# EAGLE board Adafruit IS31FL3741 Matrix (EAGLE 9.6.2)
REV: A
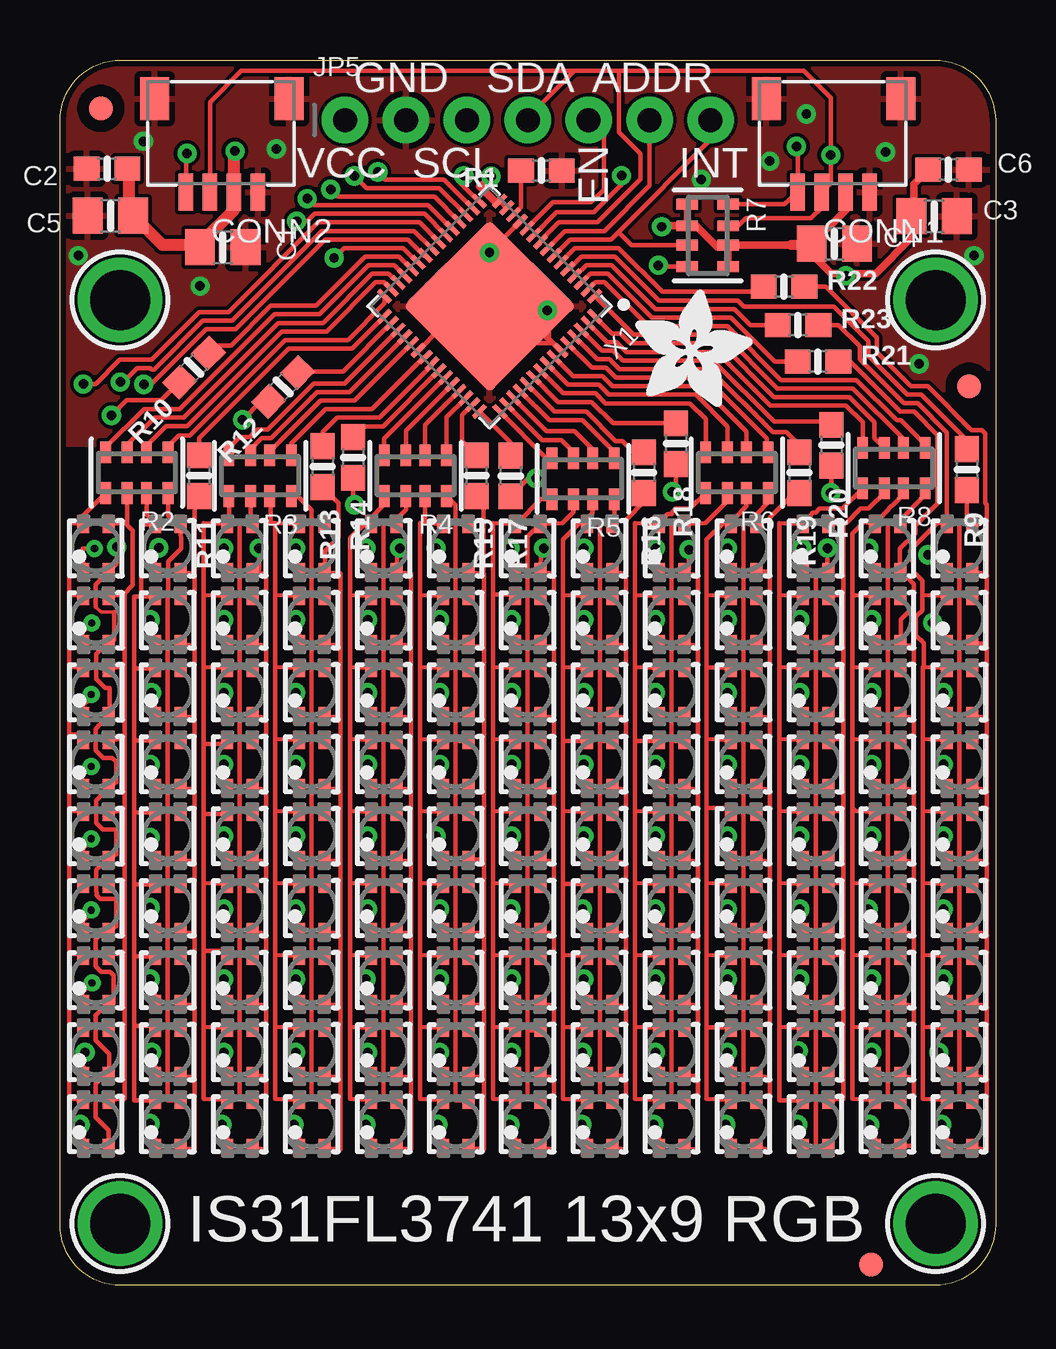
[diagram p2: board, top side]
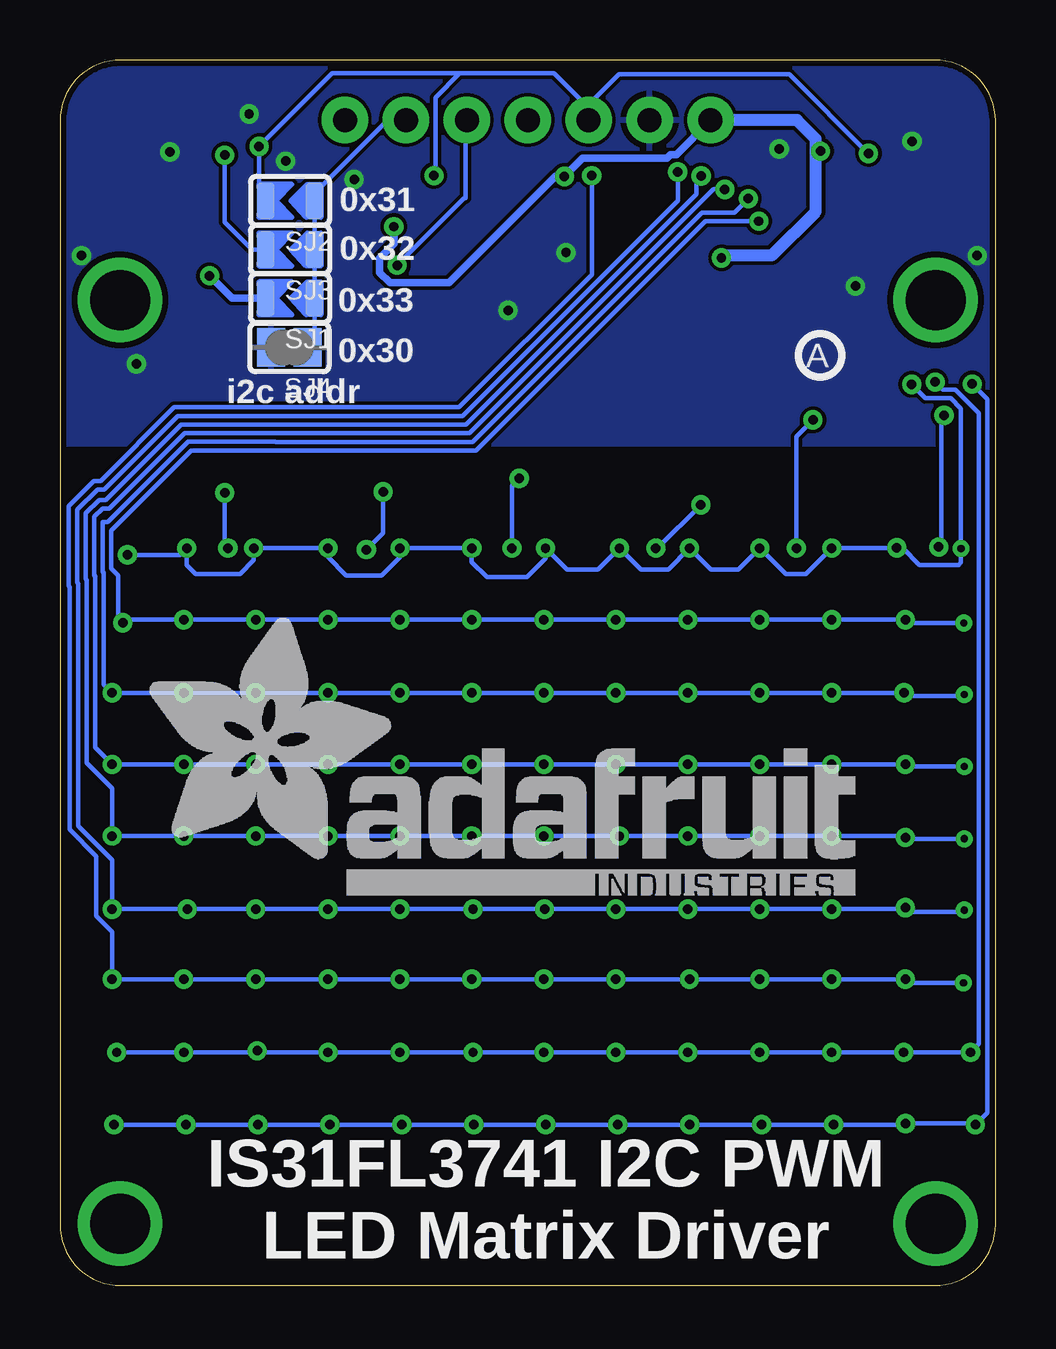
[diagram p3: board, bottom side, seen from below]

Size 39 x 51.08 mm. Coordinates in mm from the lower left corner, seen from the top.
Outline: 39,48.54 39,2.54 arc-90 36.46,0 2.54,0 arc-90 0,2.54 0,48.54 arc-90 2.54,51.08 36.46,51.08 arc-90 39,48.54
Copper layers (1*16): Top 0.035mm / dielectric 1.5mm / Bottom 0.035mm
Design rules "adafruit 6-6": minimum track width 6mil, minimum drill 15.5mil, track to track 6mil, track to pad 6mil, pad to pad 6mil, via to via 6mil, smd to smd 6mil, copper to edge 10mil, drill to drill 8mil, minimum pad ring 10mil, minimum via ring 8mil, stop-mask expansion 2mil, vias tented up to drill 20mil, thermal gap 10mil
Net classes: 1 vcc: width 0.305 mm

## Footprints (pad centres in the part's own frame; a part is rotated, then mirrored left to right if it is on the bottom)
0805-NO = smd 1.24 x 1.5: 1 -0.95,0; 2 0.95,0
0603-NO = smd 1.075 x 1: 1 -0.85,0; 2 0.85,0
JST_SH4 = smd 0.6 x 1.55: 1 -1.5,2.514; 2 -0.5,2.514; 3 0.5,2.514; 4 1.5,2.514 | smd 1.2 x 1.8: MT1 -2.8,-1.386; MT2 2.8,-1.386
FIDUCIAL_1MM = smd 1 x 1: 1 0,0
1X07_ROUND_76 = drill 1 pad 1.93: 1 -7.62,0; 2 -5.08,0; 3 -2.54,0; 4 0,0; 5 2.54,0; 6 5.08,0; 7 7.62,0
RGBLED_2121 = smd 0.75 x 0.5: A -1.05,0.525; B 0.95,0.525; G 0.95,-0.525; R -1.05,-0.525
RESPACK_4X0603 = smd 0.45 x 0.9: 1 -1.3,-0.85; 2 -0.4,-0.85; 3 0.4,-0.85; 4 1.3,-0.85; 5 1.3,0.85; 6 0.4,0.85; 7 -0.4,0.85; 8 -1.3,0.85
SOLDERJUMPER_ARROW_NOPASTE = smd 0.762 x 1.524: 1 -1.016,0; 2 1.016,0
SOLDERJUMPER_CLOSEDWIRE = smd 1.168 x 1.6: 1 -0.762,0; 2 0.762,0 | smd 0.635 x 0.203: WIRE 0,0
MOUNTINGHOLE_2.5_PLATED = drill 2.5 pad 3.2: P$1 0,0
QFN60_7MM = smd 0.7 x 0.2: 1 -3.4,2.8; 2 -3.4,2.4; 3 -3.4,2; 4 -3.4,1.6; 5 -3.4,1.2; 6 -3.4,0.8; 7 -3.4,0.4; 8 -3.4,0; 9 -3.4,-0.4; 10 -3.4,-0.8; 11 -3.4,-1.2; 12 -3.4,-1.6; 13 -3.4,-2; 14 -3.4,-2.4; 15 -3.4,-2.8; 31 3.4,-2.8; 32 3.4,-2.4; 33 3.4,-2; 34 3.4,-1.6; 35 3.4,-1.2; 36 3.4,-0.8; 37 3.4,-0.4; 38 3.4,0; 39 3.4,0.4; 40 3.4,0.8; 41 3.4,1.2; 42 3.4,1.6; 43 3.4,2; 44 3.4,2.4; 45 3.4,2.8 | smd 0.2 x 0.7: 16 -2.8,-3.4; 17 -2.4,-3.4; 18 -2,-3.4; 19 -1.6,-3.4; 20 -1.2,-3.4; 21 -0.8,-3.4; 22 -0.4,-3.4; 23 0,-3.4; 24 0.4,-3.4; 25 0.8,-3.4; 26 1.2,-3.4; 27 1.6,-3.4; 28 2,-3.4; 29 2.4,-3.4; 30 2.8,-3.4; 46 2.8,3.4; 47 2.4,3.4; 48 2,3.4; 49 1.6,3.4; 50 1.2,3.4; 51 0.8,3.4; 52 0.4,3.4; 53 0,3.4; 54 -0.4,3.4; 55 -0.8,3.4; 56 -1.2,3.4; 57 -1.6,3.4; 58 -2,3.4; 59 -2.4,3.4; 60 -2.8,3.4 | smd 5.1 x 5.1: THERMAL 0,0

## Placement (x,y rotation side)
C1  10uF  [0805-NO]  6.79,43.27 0 top
C2  1uF  [0603-NO]  1.96,46.55 180 top
C3  10uF  [0805-NO]  36.44,44.56 0 top
C4  10uF  [0805-NO]  32.28,43.41 0 top
C5  10uF  [0805-NO]  2.11,44.58 180 top
C6  1uF  [0603-NO]  37.04,46.51 0 top
CONN1  STEMMA_I2C_QT  [JST_SH4]  32.25,48.08 180 top
CONN2  STEMMA_I2C_QT  [JST_SH4]  6.75,48.08 180 top
FID1  FIDUCIAL_1MM  [FIDUCIAL_1MM]  1.7,49.07 0 top
FID2  FIDUCIAL_1MM  [FIDUCIAL_1MM]  33.8,0.86 0 top
FID3  FIDUCIAL_1MM  [FIDUCIAL_1MM]  37.9,37.48 0 top
JP5  [1X07_ROUND_76]  19.5,48.58 0 top
LED1  RGBLED_CA_2121  [RGBLED_2121]  1.5,30.78 90 top
LED2  RGBLED_CA_2121  [RGBLED_2121]  4.5,30.78 90 top
LED3  RGBLED_CA_2121  [RGBLED_2121]  7.5,30.78 90 top
LED4  RGBLED_CA_2121  [RGBLED_2121]  10.5,30.78 90 top
LED5  RGBLED_CA_2121  [RGBLED_2121]  13.5,30.78 90 top
LED6  RGBLED_CA_2121  [RGBLED_2121]  16.5,30.78 90 top
LED7  RGBLED_CA_2121  [RGBLED_2121]  19.5,30.78 90 top
LED8  RGBLED_CA_2121  [RGBLED_2121]  22.5,30.78 90 top
LED9  RGBLED_CA_2121  [RGBLED_2121]  25.5,30.78 90 top
LED10  RGBLED_CA_2121  [RGBLED_2121]  28.5,30.78 90 top
LED11  RGBLED_CA_2121  [RGBLED_2121]  31.5,30.78 90 top
LED12  RGBLED_CA_2121  [RGBLED_2121]  34.5,30.78 90 top
LED13  RGBLED_CA_2121  [RGBLED_2121]  37.5,30.78 90 top
LED14  RGBLED_CA_2121  [RGBLED_2121]  1.5,27.78 90 top
LED15  RGBLED_CA_2121  [RGBLED_2121]  4.5,27.78 90 top
LED16  RGBLED_CA_2121  [RGBLED_2121]  7.5,27.78 90 top
LED17  RGBLED_CA_2121  [RGBLED_2121]  10.5,27.78 90 top
LED18  RGBLED_CA_2121  [RGBLED_2121]  13.5,27.78 90 top
LED19  RGBLED_CA_2121  [RGBLED_2121]  16.5,27.78 90 top
LED20  RGBLED_CA_2121  [RGBLED_2121]  19.5,27.78 90 top
LED21  RGBLED_CA_2121  [RGBLED_2121]  22.5,27.78 90 top
LED22  RGBLED_CA_2121  [RGBLED_2121]  25.5,27.78 90 top
LED23  RGBLED_CA_2121  [RGBLED_2121]  28.5,27.78 90 top
LED24  RGBLED_CA_2121  [RGBLED_2121]  31.5,27.78 90 top
LED25  RGBLED_CA_2121  [RGBLED_2121]  34.5,27.78 90 top
LED26  RGBLED_CA_2121  [RGBLED_2121]  37.5,27.78 90 top
LED27  RGBLED_CA_2121  [RGBLED_2121]  1.5,24.78 90 top
LED28  RGBLED_CA_2121  [RGBLED_2121]  4.5,24.78 90 top
LED29  RGBLED_CA_2121  [RGBLED_2121]  7.5,24.78 90 top
LED30  RGBLED_CA_2121  [RGBLED_2121]  10.5,24.78 90 top
LED31  RGBLED_CA_2121  [RGBLED_2121]  13.5,24.78 90 top
LED32  RGBLED_CA_2121  [RGBLED_2121]  16.5,24.78 90 top
LED33  RGBLED_CA_2121  [RGBLED_2121]  19.5,24.78 90 top
LED34  RGBLED_CA_2121  [RGBLED_2121]  22.5,24.78 90 top
LED35  RGBLED_CA_2121  [RGBLED_2121]  25.5,24.78 90 top
LED36  RGBLED_CA_2121  [RGBLED_2121]  28.5,24.78 90 top
LED37  RGBLED_CA_2121  [RGBLED_2121]  31.5,24.78 90 top
LED38  RGBLED_CA_2121  [RGBLED_2121]  34.5,24.78 90 top
LED39  RGBLED_CA_2121  [RGBLED_2121]  37.5,24.78 90 top
LED40  RGBLED_CA_2121  [RGBLED_2121]  1.5,21.78 90 top
LED41  RGBLED_CA_2121  [RGBLED_2121]  4.5,21.78 90 top
LED42  RGBLED_CA_2121  [RGBLED_2121]  7.5,21.78 90 top
LED43  RGBLED_CA_2121  [RGBLED_2121]  10.5,21.78 90 top
LED44  RGBLED_CA_2121  [RGBLED_2121]  13.5,21.78 90 top
LED45  RGBLED_CA_2121  [RGBLED_2121]  16.5,21.78 90 top
LED46  RGBLED_CA_2121  [RGBLED_2121]  19.5,21.78 90 top
LED47  RGBLED_CA_2121  [RGBLED_2121]  22.5,21.78 90 top
LED48  RGBLED_CA_2121  [RGBLED_2121]  25.5,21.78 90 top
LED49  RGBLED_CA_2121  [RGBLED_2121]  28.5,21.78 90 top
LED50  RGBLED_CA_2121  [RGBLED_2121]  31.5,21.78 90 top
LED51  RGBLED_CA_2121  [RGBLED_2121]  34.5,21.78 90 top
LED52  RGBLED_CA_2121  [RGBLED_2121]  37.5,21.78 90 top
LED53  RGBLED_CA_2121  [RGBLED_2121]  1.5,18.78 90 top
LED54  RGBLED_CA_2121  [RGBLED_2121]  4.5,18.78 90 top
LED55  RGBLED_CA_2121  [RGBLED_2121]  7.5,18.78 90 top
LED56  RGBLED_CA_2121  [RGBLED_2121]  10.5,18.78 90 top
LED57  RGBLED_CA_2121  [RGBLED_2121]  13.5,18.78 90 top
LED58  RGBLED_CA_2121  [RGBLED_2121]  16.5,18.78 90 top
LED59  RGBLED_CA_2121  [RGBLED_2121]  19.5,18.78 90 top
LED60  RGBLED_CA_2121  [RGBLED_2121]  22.5,18.78 90 top
LED61  RGBLED_CA_2121  [RGBLED_2121]  25.5,18.78 90 top
LED62  RGBLED_CA_2121  [RGBLED_2121]  28.5,18.78 90 top
LED63  RGBLED_CA_2121  [RGBLED_2121]  31.5,18.78 90 top
LED64  RGBLED_CA_2121  [RGBLED_2121]  34.5,18.78 90 top
LED65  RGBLED_CA_2121  [RGBLED_2121]  37.5,18.78 90 top
LED66  RGBLED_CA_2121  [RGBLED_2121]  1.5,15.78 90 top
LED67  RGBLED_CA_2121  [RGBLED_2121]  4.5,15.78 90 top
LED68  RGBLED_CA_2121  [RGBLED_2121]  7.5,15.78 90 top
LED69  RGBLED_CA_2121  [RGBLED_2121]  10.5,15.78 90 top
LED70  RGBLED_CA_2121  [RGBLED_2121]  13.5,15.78 90 top
LED71  RGBLED_CA_2121  [RGBLED_2121]  16.5,15.78 90 top
LED72  RGBLED_CA_2121  [RGBLED_2121]  19.5,15.78 90 top
LED73  RGBLED_CA_2121  [RGBLED_2121]  22.5,15.78 90 top
LED74  RGBLED_CA_2121  [RGBLED_2121]  25.5,15.78 90 top
LED75  RGBLED_CA_2121  [RGBLED_2121]  28.5,15.78 90 top
LED76  RGBLED_CA_2121  [RGBLED_2121]  31.5,15.78 90 top
LED77  RGBLED_CA_2121  [RGBLED_2121]  34.5,15.78 90 top
LED78  RGBLED_CA_2121  [RGBLED_2121]  37.5,15.78 90 top
LED79  RGBLED_CA_2121  [RGBLED_2121]  1.5,12.78 90 top
LED80  RGBLED_CA_2121  [RGBLED_2121]  4.5,12.78 90 top
LED81  RGBLED_CA_2121  [RGBLED_2121]  7.5,12.78 90 top
LED82  RGBLED_CA_2121  [RGBLED_2121]  10.5,12.78 90 top
LED83  RGBLED_CA_2121  [RGBLED_2121]  13.5,12.78 90 top
LED84  RGBLED_CA_2121  [RGBLED_2121]  16.5,12.78 90 top
LED85  RGBLED_CA_2121  [RGBLED_2121]  19.5,12.78 90 top
LED86  RGBLED_CA_2121  [RGBLED_2121]  22.5,12.78 90 top
LED87  RGBLED_CA_2121  [RGBLED_2121]  25.5,12.78 90 top
LED88  RGBLED_CA_2121  [RGBLED_2121]  28.5,12.78 90 top
LED89  RGBLED_CA_2121  [RGBLED_2121]  31.5,12.78 90 top
LED90  RGBLED_CA_2121  [RGBLED_2121]  34.5,12.78 90 top
LED91  RGBLED_CA_2121  [RGBLED_2121]  37.5,12.78 90 top
LED92  RGBLED_CA_2121  [RGBLED_2121]  1.5,9.78 90 top
LED93  RGBLED_CA_2121  [RGBLED_2121]  4.5,9.78 90 top
LED94  RGBLED_CA_2121  [RGBLED_2121]  7.5,9.78 90 top
LED95  RGBLED_CA_2121  [RGBLED_2121]  10.5,9.78 90 top
LED96  RGBLED_CA_2121  [RGBLED_2121]  13.5,9.78 90 top
LED97  RGBLED_CA_2121  [RGBLED_2121]  16.5,9.78 90 top
LED98  RGBLED_CA_2121  [RGBLED_2121]  19.5,9.78 90 top
LED99  RGBLED_CA_2121  [RGBLED_2121]  22.5,9.78 90 top
LED100  RGBLED_CA_2121  [RGBLED_2121]  25.5,9.78 90 top
LED101  RGBLED_CA_2121  [RGBLED_2121]  28.5,9.78 90 top
LED102  RGBLED_CA_2121  [RGBLED_2121]  31.5,9.78 90 top
LED103  RGBLED_CA_2121  [RGBLED_2121]  34.5,9.78 90 top
LED104  RGBLED_CA_2121  [RGBLED_2121]  37.5,9.78 90 top
LED105  RGBLED_CA_2121  [RGBLED_2121]  1.5,6.78 90 top
LED106  RGBLED_CA_2121  [RGBLED_2121]  4.5,6.78 90 top
LED107  RGBLED_CA_2121  [RGBLED_2121]  7.5,6.78 90 top
LED108  RGBLED_CA_2121  [RGBLED_2121]  10.5,6.78 90 top
LED109  RGBLED_CA_2121  [RGBLED_2121]  13.5,6.78 90 top
LED110  RGBLED_CA_2121  [RGBLED_2121]  16.5,6.78 90 top
LED111  RGBLED_CA_2121  [RGBLED_2121]  19.5,6.78 90 top
LED112  RGBLED_CA_2121  [RGBLED_2121]  22.5,6.78 90 top
LED113  RGBLED_CA_2121  [RGBLED_2121]  25.5,6.78 90 top
LED114  RGBLED_CA_2121  [RGBLED_2121]  28.5,6.78 90 top
LED115  RGBLED_CA_2121  [RGBLED_2121]  31.5,6.78 90 top
LED116  RGBLED_CA_2121  [RGBLED_2121]  34.5,6.78 90 top
LED117  RGBLED_CA_2121  [RGBLED_2121]  37.5,6.78 90 top
R1  2.2K  [0603-NO]  20.07,46.47 180 top
R2  22  [RESPACK_4X0603]  3.21,33.88 180 top
R3  22  [RESPACK_4X0603]  8.34,33.75 180 top
R4  22  [RESPACK_4X0603]  14.82,33.75 180 top
R5  22  [RESPACK_4X0603]  21.8,33.62 180 top
R6  22  [RESPACK_4X0603]  28.22,33.88 180 top
R7  4.7K  [RESPACK_4X0603]  27,43.76 270 top
R8  22  [RESPACK_4X0603]  34.76,34.07 180 top
R9  22  [0603-NO]  37.81,34.01 270 top
R10  51  [0603-NO]  5.59,38.26 225 top
R11  51  [0603-NO]  5.8,33.75 270 top
R12  51  [0603-NO]  9.3,37.45 225 top
R13  51  [0603-NO]  10.95,34.13 270 top
R14  51  [0603-NO]  12.22,34.51 270 top
R15  51  [0603-NO]  17.36,33.75 270 top
R16  51  [0603-NO]  24.34,33.88 270 top
R17  51  [0603-NO]  18.79,33.75 270 top
R18  51  [0603-NO]  25.68,35.09 270 top
R19  51  [0603-NO]  30.82,33.88 270 top
R20  51  [0603-NO]  32.16,35.02 270 top
R21  51  [0603-NO]  31.6,38.5 0 top
R22  51  [0603-NO]  30.19,41.63 0 top
R23  22  [0603-NO]  30.76,40.03 0 top
SJ1  [SOLDERJUMPER_ARROW_NOPASTE]  29.41,41.15 180 bottom
SJ2  [SOLDERJUMPER_ARROW_NOPASTE]  29.41,45.21 180 bottom
SJ3  [SOLDERJUMPER_ARROW_NOPASTE]  29.41,43.18 180 bottom
SJ4  [SOLDERJUMPER_CLOSEDWIRE]  29.44,39.1 180 bottom
U$3  MOUNTINGHOLE2.5  [MOUNTINGHOLE_2.5_PLATED]  2.5,2.58 0 top
U$4  MOUNTINGHOLE2.5  [MOUNTINGHOLE_2.5_PLATED]  36.5,2.58 0 top
U$5  MOUNTINGHOLE2.5  [MOUNTINGHOLE_2.5_PLATED]  2.5,41.08 180 top
U$6  MOUNTINGHOLE2.5  [MOUNTINGHOLE_2.5_PLATED]  36.5,41.08 180 top
U$10  [ADAFRUIT_5MM]  24,36.63 0 top
U$11  [PCBFEAT-REV-040]  7.3,38.77 180 bottom
U$16  [ADAFRUIT_TEXT_30MM]  35.5,16.28 0 bottom
X1  IS31FL3741  [QFN60_7MM]  17.91,40.81 225 top

## Tracks (layer width: path | path; a pad name or v marks a point on that pad's centre or on a via)
ADDR
  Top 0.178: X1.8 21.05,43.95 22.69,43.95 24.58,45.85 JP5.6
  Bottom 0.178: SJ2.1 SJ3.1 | SJ3.1 SJ1.1 28.39,39.1 SJ4.1 | SJ3.1 28.39,45.52 25.34,48.57 JP5.6
B1
  Top 0.178: 0.38,28.78 0.38,31.78 LED1.B 0.95,32.07 R2.5 | 0.38,28.78 LED14.B | 0.38,28.78 0.38,25.78 | LED27.B 0.38,25.78 | 0.38,25.78 0.38,22.96 | 0.38,22.96 0.38,19.78 | 0.38,19.78 0.38,16.86 | 0.38,16.86 0.38,13.81 | 0.38,13.81 0.38,10.89 | 0.38,10.89 0.38,7.78 LED105.B | LED92.B 1,10.89 0.38,10.89 | LED79.B 1,13.81 0.38,13.81 | LED66.B 1,16.86 0.38,16.86 | LED53.B 1,19.78 0.38,19.78 | LED40.B 1,22.96 0.38,22.96
B2
  Top 0.178: LED106.B 3.89,7.72 3.09,7.72 3.09,10.83 | 3.4,28.72 3.4,31.72 3.89,31.72 LED2.B 3.61,32.12 R2.7 | 3.09,25.72 3.09,28.72 3.4,28.72 | 3.09,25.72 3.09,22.72 | 3.09,22.72 3.09,19.72 | 3.09,19.72 3.09,16.72 | 3.09,16.72 3.09,13.72 | 3.09,13.72 3.09,10.83 | 3.09,10.83 3.95,10.83 LED93.B | LED80.B 3.89,13.72 3.09,13.72 | LED67.B 3.89,16.72 3.09,16.72 | LED54.B 3.89,19.72 3.09,19.72 | LED41.B 3.89,22.72 3.09,22.72 | LED28.B 3.89,25.72 3.09,25.72 | LED15.B 3.89,28.72 3.4,28.72
CS1
  Top 0.178: R10.1 6.51,39.18 7.14,39.18 8.79,40.83 10.67,40.83 12.72,42.89 14.14,42.89 X1.26
CS2
  Top 0.178: X1.27 13.93,42.53 12.87,42.53 10.81,40.48 8.94,40.48 5,36.54 3.5,36.54 1.91,34.95 R2.4
CS3
  Top 0.178: R2.3 2.81,35.05 3.94,36.18 5.15,36.18 9.09,40.12 10.96,40.12 13.02,42.18 13.71,42.18 13.96,41.93 13.97,41.93 X1.28
CS4
  Top 0.178: X1.29 13.51,41.82 13.16,41.82 11.11,39.77 9.23,39.77 5.29,35.83 4.43,35.83 3.61,35.01 R2.2
CS5
  Top 0.178: X1.30 13.53,40.93 12,39.41 9.38,39.41 5.4,35.43 4.95,35.43 4.51,34.98 R2.1
CS6
  Top 0.178: X1.31 13.51,40.39 12.18,39.05 9.53,39.05 5.8,35.33 R11.1
CS7
  Top 0.178: X1.32 11.81,38.1 9.95,38.1 R12.1
CS8
  Top 0.178: X1.33 11.86,37.59 10.57,37.59 8.66,35.67 8.22,35.67 7.91,35.36 7.49,35.36 7.04,34.92 R3.4
CS9
  Top 0.178: X1.34 12.07,37.23 10.72,37.23 8.8,35.32 8.41,35.32 7.94,34.85 R3.3
CS10
  Top 0.178: X1.35 12.28,36.88 10.87,36.88 8.74,34.75 R3.2
CS11
  Top 0.178: X1.37 15.18,38.69 13.02,36.52 11.07,36.52 9.64,35.09 R3.1
CS12
  Top 0.178: X1.38 15.51,38.36 13.32,36.17 11.54,36.17 10.95,35.57 R13.1
CS13
  Top 0.178: X1.39 13.47,35.81 12.66,35.81 R14.1
CS14
  Top 0.178: R4.4 13.52,35.3 16.06,37.84 X1.40
CS15
  Top 0.178: R4.3 14.42,35.62 X1.41
CS16
  Top 0.178: R4.2 15.22,35.86 X1.42
CS17
  Top 0.178: R4.1 16.12,36.19 X1.43
CS18
  Top 0.178: X1.44 16.76,36.27 16.76,35.2 R15.1
CS19
  Top 0.178: X1.45 18.79,35.13 R17.1
CS20
  Top 0.178: X1.46 20.29,34.48 R5.4
CS21
  Top 0.178: X1.47 20.09,35.24 20.9,35.24 21.4,34.73 R5.3
CS22
  Top 0.178: X1.48 20.28,35.62 21.44,35.62 22.2,34.86 R5.2
CS23
  Top 0.178: X1.49 20.4,36.06 21.77,36.06 23.11,34.73 R5.1
CS24
  Top 0.178: X1.50 20.61,36.42 21.94,36.42 23.16,35.19 23.44,35.19 23.9,34.73 R16.1
CS25
  Top 0.178: X1.51 20.76,36.83 22.16,36.83 23.06,35.94 R18.1
CS26
  Top 0.178: X1.52 20.97,37.19 22.31,37.19 22.73,36.77 26.26,36.77 26.92,36.11 R6.4
CS27
  Top 0.178: X1.53 21.18,37.54 22.46,37.54 22.88,37.12 26.5,37.12 27.82,35.81 R6.3
CS28
  Top 0.178: X1.54 21.39,37.9 22.62,37.9 23.04,37.48 26.72,37.48 28.62,35.58 R6.2
CS29
  Top 0.178: X1.56 22.17,38.25 22.77,38.25 23.17,37.85 26.92,37.85 29.46,35.31 29.46,34.78 R6.1
CS30
  Top 0.178: X1.57 22.38,38.61 22.91,38.61 23.32,38.2 27.07,38.2 29.71,35.56 30.29,35.56 30.82,35.03 R19.1
CS31
  Top 0.178: X1.58 22.59,38.96 23.06,38.96 23.47,38.56 27.22,38.56 29.77,36 32.02,36 R20.1
CS32
  Top 0.178: X1.59 22.8,39.32 23.21,39.32 23.61,38.91 27.38,38.91 29.62,36.68 32.77,36.68 33.46,35.98 R8.4
CS33
  Top 0.178: X1.60 23.01,39.67 23.36,39.67 23.76,39.27 27.53,39.27 29.77,37.03 32.91,37.03 33.95,35.99 33.95,35.33 R8.3
CS34
  Top 0.178: X1.1 23.5,40.03 23.91,39.62 27.68,39.62 29.91,37.39 33.06,37.39 35.16,35.29 R8.2
CS35
  Top 0.178: X1.2 22.32,41.82 22.7,41.82 24.54,39.98 27.82,39.98 30.06,37.74 33.21,37.74 34.88,36.07 35.06,36.07 36.06,35.07 R8.1
CS36
  Top 0.178: R21.1 29.8,38.5 27.97,40.34 24.68,40.34 22.84,42.18 22.11,42.18 X1.3
CS37
  Top 0.178: R23.1 28.78,40.03 28.11,40.7 24.82,40.7 22.99,42.53 21.94,42.53 21.5,42.09 X1.4
CS38
  Top 0.178: X1.5 21.21,42.37 21.73,42.89 23.14,42.89 24.97,41.06 28.25,41.06 28.52,40.8 32.26,40.8 33.69,39.36 33.69,38.77 35.32,37.13 35.9,37.13 37.81,35.23 R9.1
CS39
  Top 0.178: R22.1 29.12,41.41 25.11,41.41 23.28,43.24 21.48,43.24 X1.6
G1
  Top 0.178: LED14.G 2.63,28.78 | 2.63,28.78 2.69,28.78 2.69,25.78 | 2.69,25.78 LED27.G | 2.69,25.78 2.69,22.78 | 2.69,22.78 2.69,19.78 | 2.69,19.78 2.69,16.86 | 2.69,16.86 2.69,13.81 | 2.69,13.81 2.69,10.89 | 2.69,10.89 2.69,7.78 LED105.G | LED92.G 2,10.89 2.69,10.89 | LED79.G 2,13.81 2.69,13.81 | LED66.G 2,16.86 2.69,16.86 | LED53.G 2.69,19.78 | LED40.G 2.69,22.78 | 2.63,28.78 3.04,29.19 3.04,31.47 2.81,31.7 2.81,31.79 | R2.6 2.81,31.79 | 2.81,31.79 2.8,31.78 LED1.G
G2
  Top 0.178: 4.49,28.66 4.49,28.78 LED15.G | 4.49,28.66 4.49,25.78 | 4.49,25.78 4.49,22.78 | 4.49,22.78 4.49,19.78 | 4.49,19.78 4.49,16.78 | 4.49,16.78 4.49,13.78 | 4.49,13.78 4.49,10.78 | 4.49,10.78 4.49,7.72 5.05,7.72 LED106.G | LED93.G 4.49,10.78 | LED80.G 4.49,13.78 | LED67.G 4.49,16.78 | LED54.G 4.49,19.78 | LED41.G 4.49,22.78 | LED28.G 4.49,25.78 | R2.8 4.51,32.08 4.81,31.78 LED2.G 5.04,30.71 4.51,30.18 4.51,28.68 4.49,28.66
GND  (via drill 0.39)
  Top 0.178: X1.36 15.83,39.86 | 15.83,39.86 15.91,39.94 | 17.66,40.56 16.96,39.86 15.83,39.86 | 17.66,40.56 17.82,40.72 | 17.66,40.56 18.95,39.28 20.53,39.28 20.84,38.97 X1.55 20.32,39.54 | X1.THERMAL 17.82,40.72 | X1.12 17.82,42.99 17.82,40.72
  Top 0.305: 20.32,39.54 v20.32,40.64
  other vias: 5.84,41.66 0.76,42.93 3.48,47.69 9.02,47.37 17.91,43.05 29.59,46.86 34.42,47.24 35.81,38.42 38.1,42.93 31.11,48.83 26.73,46.1
  pour Top: 0,51.05 38.99,51.05 38.99,35.05 0,35.05
  pour Bottom: 0,51.05 38.99,51.05 38.99,35.05 0,35.05
INT
  Top 0.178: X1.7 21.27,43.6 22.97,43.6 23.27,43.91 | JP5.7 27.12,47.75 23.27,43.91 | R7.3 23.82,43.36 23.27,43.91
N$4
  Top 0.178: X1.13 19.22,44.95 R1.2
N$8
  Top 0.178: LED107.G 7.49,7.78 7.49,10.78 | 7.49,28.78 7.49,31.78 LED3.G 7.94,31.89 R3.6 | 7.49,28.78 7.49,25.78 | 7.49,25.78 7.49,22.78 | 7.49,22.78 7.49,19.78 | 7.49,19.78 7.49,16.78 | 7.49,16.78 7.49,13.78 | 7.49,13.78 7.49,10.78 | LED94.G 7.49,10.78 | LED81.G 7.49,13.78 | LED68.G 7.49,16.78 | LED55.G 7.49,19.78 | LED42.G 7.49,22.78 | LED29.G 7.49,25.78 | LED16.G 7.49,28.78
N$10
  Top 0.178: LED108.R 11.71,5.68 11.71,8.68 | 11.71,26.68 11.71,29.68 LED4.R 11.04,30.6 11.62,31.18 11.62,32.61 R13.2 | 11.71,26.68 11.71,23.68 | 11.71,23.68 11.71,20.68 | 11.71,20.68 11.71,17.68 | 11.71,17.68 11.71,14.68 | 11.71,14.68 11.71,11.68 | 11.71,11.68 11.71,8.68 | LED95.R 11.71,8.68 | LED82.R 11.71,11.68 | LED69.R 11.71,14.68 | LED56.R 11.71,17.68 | LED43.R 11.71,20.68 | LED30.R 11.71,23.68 | LED17.R 11.71,26.68
N$12
  Top 0.178: LED4.B 8.96,31.78 | 8.96,31.78 8.77,31.78 8.77,32.87 R3.7 | LED108.B 8.96,7.78 8.96,10.78 | 8.96,31.78 8.96,28.78 | 8.96,28.78 8.96,25.78 | 8.96,25.78 8.96,22.78 | 8.96,22.78 8.96,19.78 | 8.96,19.78 8.96,16.78 | 8.96,16.78 8.96,13.78 | 8.96,13.78 8.96,10.78 | LED95.B 8.96,10.78 | LED82.B 8.96,13.78 | LED69.B 8.96,16.78 | LED56.B 8.96,19.78 | LED43.B 8.96,22.78 | LED30.B 8.96,25.78 | LED17.B 8.96,28.78
N$14
  Top 0.178: LED109.G 13.49,7.78 13.49,10.78 | 13.49,28.78 13.49,31.78 LED5.G 14.05,31.97 14.42,32.34 R4.6 | 13.49,28.78 13.49,25.78 | 13.49,25.78 13.49,22.78 | 13.49,22.78 13.49,19.78 | 13.49,19.78 13.49,16.78 | 13.49,16.78 13.49,13.78 | 13.49,13.78 13.49,10.78 | LED96.G 13.49,10.78 | LED83.G 13.49,13.78 | LED70.G 13.49,16.78 | LED57.G 13.49,19.78 | LED44.G 13.49,22.78 | LED31.G 13.49,25.78 | LED18.G 13.49,28.78
N$16
  Top 0.178: LED6.G 16.49,31.78 | 16.49,31.78 16.49,28.78 | 16.49,28.78 16.49,25.78 | 16.49,25.78 16.49,22.7 | 16.49,22.7 16.49,19.78 | 16.49,19.78 16.49,16.86 | 16.49,16.86 16.49,13.81 | 16.49,13.81 16.49,10.89 | 16.49,10.89 16.49,7.72 17.05,7.72 LED110.G | LED97.G 17.05,10.89 16.49,10.89 | LED84.G 17.05,13.81 16.49,13.81 | LED71.G 17.05,16.86 16.49,16.86 | LED58.G 16.49,19.78 | LED45.G 17.05,22.7 16.49,22.7 | LED32.G 16.49,25.78 | LED19.G 16.49,28.78 | R4.8 16.49,32.53 16.49,31.78
N$17  (via drill 0.39)
  Top 0.178: LED111.R 20.6,5.68 20.6,8.68 | 20.6,26.64 20.6,29.68 LED7.R 20.05,30.63 v20.16,30.73 | 20.6,26.64 20.6,23.68 | 20.6,23.68 20.6,20.67 | 20.6,20.67 20.6,17.68 | 20.6,17.68 20.6,14.68 | 20.6,14.68 20.6,11.68 | 20.6,11.68 20.6,8.68 | LED98.R 20.6,8.68 | LED85.R 20.6,11.68 | LED72.R 20.6,14.68 | LED46.R 20.05,20.67 20.6,20.67 | LED20.R 20.05,26.64 20.6,26.64 | LED33.R 20.6,23.68 | LED59.R 20.6,17.68 | R17.2 19.54,33.65 v19.86,33.65
  Bottom 0.178: v19.86,33.65 20.16,33.35 v20.16,30.73
N$19
  Top 0.178: 23.59,29.68 23.59,26.68 | 23.59,26.68 23.59,23.68 | 23.59,23.68 23.59,20.68 | 23.59,20.68 23.59,17.62 | 23.59,17.62 23.59,14.7 | 23.59,14.7 23.59,11.65 | 23.59,11.65 23.59,8.73 | 23.59,8.73 23.59,5.68 LED112.R | LED8.R 23.59,29.68 | LED21.R 23.59,26.68 | LED34.R 23.59,23.68 | LED47.R 23.59,20.68 | LED60.R 23.05,17.62 23.59,17.62 | LED73.R 23.05,14.7 23.59,14.7 | LED86.R 23.05,11.65 23.59,11.65 | LED99.R 23.05,8.73 23.59,8.73 | 23.59,29.68 23.61,29.7 23.61,31.93 24.34,32.66 R16.2
N$21  (via drill 0.39)
  Top 0.178: LED113.R 26.07,5.66 26.59,5.66 26.59,8.73 | 26.59,26.68 26.59,29.63 26.1,29.63 LED9.R 26.23,29.86 v26.23,30.67 | 26.59,26.68 26.59,23.59 | 26.59,23.59 26.59,20.68 | 26.59,20.68 26.59,17.68 | 26.59,17.68 26.59,14.68 | 26.59,14.68 26.59,11.68 | 26.59,11.68 26.59,8.73 | LED22.R 26.59,26.68 | LED35.R 26.05,23.59 26.59,23.59 | LED48.R 26.59,20.68 | LED61.R 26.59,17.68 | LED74.R 26.59,14.68 | LED100.R 26.05,8.73 26.59,8.73 | LED87.R 26.59,11.68 | R18.2 25.68,33.23 v25.53,33.08
  Bottom 0.178: v25.53,33.08 25.53,31.37 v26.23,30.67
N$22
  Top 0.178: LED113.B 23.96,7.78 23.96,10.78 | 23.96,28.78 23.96,31.78 LED9.B 25.33,32.16 25.51,32.16 25.51,32.22 25.66,32.37 26.26,32.37 R6.5 | 23.96,28.78 23.96,25.78 | 23.96,25.78 23.96,22.7 | 23.96,22.7 23.96,19.78 | 23.96,19.78 23.96,16.78 | 23.96,16.78 23.96,13.78 | 23.96,13.78 23.96,10.78 | LED22.B 23.96,28.78 | LED35.B 23.96,25.78 | LED48.B 24.95,22.7 23.96,22.7 | LED61.B 23.96,19.78 | LED74.B 23.96,16.78 | LED87.B 23.96,13.78 | LED100.B 23.96,10.78
N$24
  Top 0.178: LED114.G 28.49,7.78 28.49,10.77 | 28.49,10.77 28.49,13.78 | 28.49,13.78 28.49,16.78 | 28.49,16.78 28.49,19.91 | 28.49,19.91 28.49,22.78 | 28.49,22.78 28.49,25.78 | 28.49,25.78 28.49,28.78 | 28.49,28.78 28.49,31.85 29.05,31.85 LED10.G 29.05,32.16 29.52,32.63 R6.8 | LED101.G 29.05,10.77 28.49,10.77 | LED88.G 28.49,13.78 | LED75.G 28.49,16.78 | LED62.G 29.05,19.91 28.49,19.91 | LED49.G 28.49,22.78 | LED36.G 28.49,25.78 | LED23.G 28.49,28.78
N$25  (via drill 0.39)
  Top 0.178: LED115.R 32.03,5.66 31.51,5.66 31.51,8.73 | 31.51,8.73 31.51,11.65 | 31.51,11.65 31.51,14.68 | 31.51,14.68 31.51,17.68 | 31.51,17.68 31.51,20.68 | 31.51,20.68 31.51,23.68 | 31.51,23.68 31.51,26.64 | 31.51,26.64 31.51,29.75 31.98,29.75 LED11.R 32,29.73 v32,30.73 | 31.51,8.73 32.05,8.73 LED102.R | 31.51,11.65 32.05,11.65 LED89.R | LED37.R 31.51,23.68 | LED50.R 31.51,20.68 | LED63.R 31.51,17.68 | LED76.R 31.51,14.68 | 31.51,26.64 32.05,26.64 LED24.R | R20.2 32.16,33.06 v32.13,33.04
  Bottom 0.178: v32,30.73 32.13,30.87 v32.13,33.04
N$27
  Top 0.178: 30,28.78 30,31.78 LED11.B 31.39,32.23 31.52,32.23 31.66,32.37 32.61,32.37 R8.5 | 30,28.78 30,25.78 | 30,25.78 30,22.78 | 30,22.78 30,19.78 | 30,19.78 30,16.78 | 30,16.78 30,13.78 | 30,13.78 30,10.78 | 30,10.78 30,7.72 30.95,7.72 LED115.B | LED102.B 30,10.78 | LED89.B 30,13.78 | LED76.B 30,16.78 | LED63.B 30,19.78 | LED50.B 30,22.78 | LED37.B 30,25.78 | LED24.B 30,28.78
N$29
  Top 0.178: LED116.G 34.51,7.78 34.51,10.77 | 34.51,28.67 34.51,31.78 LED12.G 35.05,31.93 36.06,32.94 R8.8 | 34.51,28.67 34.51,25.88 | 34.51,25.88 34.51,22.83 | 34.51,22.83 34.51,19.78 | 34.51,19.78 34.51,16.73 | 34.51,16.73 34.51,13.78 | 34.51,13.78 34.51,10.77 | LED103.G 35.05,10.77 34.51,10.77 | LED90.G 34.51,13.78 | LED51.G 34.56,22.78 34.51,22.83 | LED64.G 34.51,19.78 | LED38.G 34.61,25.78 34.51,25.88 | LED25.G 34.62,28.78 34.51,28.67 | LED77.G 34.55,16.78 34.51,16.73
N$31
  Top 0.178: LED13.R 38.63,29.68 | LED117.R 38.63,5.68 38.63,8.68 | 38.63,26.77 38.63,29.68 | 38.63,26.77 38.63,23.68 | 38.63,23.68 38.63,20.68 | 38.63,20.68 38.63,17.68 | 38.63,17.68 38.63,14.68 | 38.63,14.68 38.63,11.68 | 38.63,11.68 38.63,8.68 | LED26.R 38.05,26.77 38.63,26.77 | LED39.R 38.63,23.68 | LED52.R 38.63,20.68 | LED65.R 38.63,17.68 | LED78.R 38.63,14.68 | LED91.R 38.63,11.68 | LED104.R 38.63,8.68 | 38.63,29.68 38.63,32.55 38.57,32.61 38.57,35.5 38.42,35.66 38,35.66 36.17,37.49 35.47,37.49 34.05,38.91 34.05,39.51 31.93,41.63 R22.2
N$33
  Top 0.178: LED117.B 35.97,7.78 35.97,10.78 | 35.97,22.78 35.97,25.78 36.01,25.78 | 35.97,22.78 35.97,19.78 | 35.97,19.78 35.97,16.78 | 35.97,16.78 35.97,13.78 | 35.97,13.78 35.97,10.78 | LED104.B 35.97,10.78 | LED91.B 35.97,13.78 | LED78.B 35.97,16.78 | LED65.B 35.97,19.78 | LED52.B 35.97,22.78 | LED39.B 36.01,25.78 | LED26.B 35.97,28.78 | R23.2 32.46,40.03 33.34,39.15 33.34,38.62 35.18,36.78 35.75,36.78 36.98,35.56 36.98,31.81 LED13.B 36.57,31.78 35.45,30.66 35.45,30.27 35.59,30.13 35.59,29.74 35.95,29.38 35.95,28.8 35.97,28.78 | 35.97,28.78 35.95,28.76 35.95,28.14 35.69,27.88 35.69,27.09 36.01,26.77 36.01,25.78
N$41  (via drill 0.39)
  Top 0.178: LED3.R 8.13,29.68 | 8.13,29.68 8.59,29.68 8.59,26.68 | 8.59,26.68 8.59,23.68 | 8.59,23.68 8.59,20.68 | 8.59,20.68 8.59,17.68 | 8.59,17.68 8.59,14.68 | 8.59,14.68 8.59,11.68 | 8.59,11.68 8.59,8.73 | 8.59,8.73 8.59,5.68 LED107.R | LED94.R 8.05,8.73 8.59,8.73 | LED81.R 8.59,11.68 | LED68.R 8.59,14.68 | LED55.R 8.59,17.68 | LED42.R 8.59,20.68 | LED29.R 8.59,23.68 | LED16.R 8.59,26.68 | R12.2 8.39,36.85 v7.61,36.08 | v8.3,30.73 8.3,29.85 8.13,29.68
  Bottom 0.178: v7.61,36.08 8.3,35.39 v8.3,30.73
N$43
  Top 0.178: LED107.B 5.99,7.78 5.99,10.78 | 5.99,28.78 5.99,31.78 LED3.B 6.95,31.97 7.04,32.06 R3.5 | 5.99,25.78 5.99,22.73 5.99,22.58 | 5.99,19.66 5.99,22.58 | 5.99,19.66 5.99,16.76 | 5.99,13.94 5.99,10.78 | 5.99,10.78 LED94.B | 5.99,13.94 6.95,13.94 | 6.95,13.94 LED81.B 6.95,13.94 | LED55.B 6.95,19.66 5.99,19.66 | LED42.B 6.95,22.58 5.99,22.58 | LED29.B 5.99,25.78 | LED16.B 5.99,28.78 | 5.99,13.94 6.95,13.94 | 5.99,13.94 5.99,16.76 | 5.99,16.76 6.01,16.78 LED68.B | 5.99,25.78 5.99,28.78 | 5.99,22.58
N$46
  Top 0.178: LED4.G 10.49,31.78 | LED108.G 10.49,7.78 10.49,10.78 | 10.49,31.78 10.49,28.78 | 10.49,28.78 10.49,25.78 | 10.49,25.78 10.49,22.78 | 10.49,22.78 10.49,19.78 | 10.49,19.78 10.49,16.78 | 10.49,16.78 10.49,13.78 | 10.49,13.78 10.49,10.78 | LED95.G 10.49,10.78 | LED82.G 10.49,13.78 | LED69.G 10.49,16.78 | LED56.G 10.49,19.78 | LED43.G 10.49,22.78 | LED30.G 10.49,25.78 | LED17.G 10.49,28.78 | R3.8 9.91,32.9 10.49,32.32 10.49,31.78
N$48  (via drill 0.39)
  Top 0.178: LED109.R 14.63,5.68 14.63,8.68 | 14.63,26.68 14.63,29.68 LED5.R 14.05,30.62 v14.16,30.73 | 14.63,26.68 14.63,23.68 | 14.63,23.68 14.63,20.68 | 14.63,20.68 14.63,17.68 | 14.63,17.68 14.63,14.68 | 14.63,14.68 14.63,11.68 | 14.63,11.68 14.63,8.68 | LED96.R 14.63,8.68 | LED83.R 14.63,11.68 | LED70.R 14.63,14.68 | LED57.R 14.63,17.68 | LED44.R 14.63,20.68 | LED31.R 14.63,23.68 | LED18.R 14.63,26.68 | R14.2 12.22,32.53 v12.28,32.53 v12.29,32.53
  Bottom 0.178: v12.29,32.53 14.09,30.73 v14.16,30.73
N$50
  Top 0.178: LED109.B 12.09,7.78 12.09,10.78 | 12.09,28.78 12.09,31.15 12.81,31.87 LED5.B 12.95,31.97 13.52,32.54 R4.5 | 12.09,28.78 12.09,25.78 | 12.09,25.78 12.09,22.78 | 12.09,22.78 12.09,19.78 | 12.09,19.78 12.09,16.78 | 12.09,16.78 12.09,13.78 | 12.09,13.78 12.09,10.78 | LED96.B 12.09,10.78 | LED83.B 12.09,13.78 | LED70.B 12.09,16.78 | LED57.B 12.09,19.78 | LED44.B 12.09,22.78 | LED31.B 12.09,25.78 | LED18.B 12.09,28.78
N$52
  Top 0.178: LED6.R 17.53,29.68 | 17.53,29.68 17.68,29.68 17.68,26.64 | LED110.R 17.68,5.68 17.68,8.68 | 17.68,26.64 17.68,23.59 | 17.68,23.59 17.68,20.54 | 17.68,20.54 17.68,17.75 | 17.68,17.75 17.68,14.68 | 17.68,14.68 17.68,11.68 | 17.68,11.68 17.68,8.68 | LED97.R 17.68,8.68 | LED84.R 17.68,11.68 | LED71.R 17.68,14.68 | LED58.R 17.05,17.75 17.68,17.75 | LED45.R 17.05,20.54 17.68,20.54 | LED32.R 17.05,23.59 17.68,23.59 | LED19.R 17.05,26.64 17.68,26.64 | R15.2 17.55,32.9 17.65,32.8 17.65,29.81 17.53,29.68
N$54
  Top 0.178: LED110.B 15.01,7.78 15.01,10.78 | 15.22,31.78 15.01,31.78 15.01,28.78 | 15.01,10.78 15.01,13.78 | 15.01,13.78 15.01,16.78 | 15.01,16.78 15.01,19.78 | 15.01,19.78 15.01,22.78 | 15.01,22.78 15.01,25.78 | 15.01,25.78 15.01,28.78 | LED19.B 15.01,28.78 | LED32.B 15.01,25.78 | LED45.B 15.01,22.78 | LED58.B 15.01,19.78 | LED71.B 15.01,16.78 | LED84.B 15.01,13.78 | LED97.B 15.01,10.78 | R4.7 15.22,31.78 | LED6.B 15.22,31.78
N$57
  Top 0.178: LED111.G 19.49,7.78 19.49,10.64 | 19.49,28.8 19.49,31.22 LED7.G 20.94,31.78 21.4,32.25 R5.6 | 19.49,28.8 19.49,25.78 | 19.49,25.78 19.49,22.78 | 19.49,22.78 19.49,19.78 | 19.49,19.78 19.49,16.78 | 19.49,16.78 19.49,13.78 | 19.49,13.78 19.49,10.64 | LED72.G 19.49,16.78 | LED85.G 19.49,13.78 | LED98.G 20.05,10.64 19.49,10.64 | LED46.G 19.49,22.78 | LED59.G 19.49,19.78 | LED33.G 19.49,25.78 | LED20.G 20.05,28.8 19.49,28.8
N$59
  Top 0.178: LED111.B 18.06,7.78 18.06,10.78 | 18.06,28.8 18.06,31.78 LED7.B 19.07,31.78 20.06,32.77 R5.5 | 18.06,25.78 18.06,25.65 18.06,22.78 | 18.06,22.78 18.06,19.78 | 18.06,19.78 18.06,16.78 | 18.06,16.78 18.06,13.78 | 18.06,13.78 18.06,10.78 | LED98.B 18.06,10.78 | LED85.B 18.06,13.78 | LED72.B 18.06,16.78 | LED59.B 18.06,19.78 | LED46.B 18.06,22.78 | LED33.B 18.06,25.78 | 18.06,28.8 | 18.93,28.8 LED20.B 18.95,28.8 18.93,28.8 | 18.93,28.8 18.06,28.8 | 18.06,28.8 | 18.06,28.8 18.06,25.78
N$62
  Top 0.178: LED112.G 22.5,7.78 22.5,10.78 | 22.5,28.78 22.5,31.78 LED8.G 23.11,31.84 R5.8 | 22.5,28.78 22.5,25.78 | 22.5,25.78 22.5,22.7 | 22.5,22.7 22.5,19.78 | 22.5,19.78 22.5,16.73 | 22.5,16.73 22.5,13.81 | 22.5,13.81 22.5,10.78 | LED21.G 22.5,28.78 | LED34.G 22.5,25.78 | LED47.G 23.05,22.7 22.5,22.7 | LED60.G 22.5,19.78 | LED73.G 23.05,16.73 22.5,16.73 | LED86.G 23.05,13.81 22.5,13.81 | LED99.G 22.5,10.78
N$65
  Top 0.178: LED8.B 21.78,31.78 21.95,31.95 | LED112.B 20.96,7.78 20.96,10.78 | 20.96,28.78 20.96,31.08 21.83,31.95 21.95,31.95 | 20.96,28.78 20.96,25.78 | 20.96,25.78 20.96,22.7 | 20.96,22.7 20.96,19.78 | 20.96,19.78 20.96,16.76 20.96,16.73 | 20.96,16.73 20.96,16.64 20.96,13.78 | 20.96,10.78 20.96,13.78 | LED21.B 20.96,28.78 | LED34.B 20.96,25.78 | LED47.B 21.95,22.7 20.96,22.7 | LED60.B 20.96,19.78 | LED73.B 21.95,16.73 20.96,16.73 | LED99.B 20.96,10.78 | R5.7 22.2,32.2 21.95,31.95 | LED86.B 20.96,13.78 | 20.96,16.73
N$67
  Top 0.178: LED113.G 25.49,7.78 25.49,10.77 | 25.49,28.78 25.49,31.78 LED9.G 26.91,31.78 27.82,32.69 R6.6 | 25.49,28.78 25.49,25.78 | 25.49,25.78 25.49,22.7 | 25.49,22.7 25.49,19.78 | 25.49,19.78 25.49,16.78 | 25.49,16.78 25.49,13.78 | 25.49,13.78 25.49,10.77 | 25.49,28.78 LED22.G | LED35.G 25.49,25.78 | LED48.G 26.05,22.7 25.49,22.7 | LED61.G 25.49,19.78 | LED74.G 25.49,16.78 | LED87.G 25.49,13.78 | LED100.G 26.05,10.77 25.49,10.77
N$69
  Top 0.178: LED10.R 29.12,29.75 29.59,29.75 | 29.59,26.64 29.59,29.75 | 29.59,26.64 29.59,23.68 | 29.59,23.68 29.59,20.68 | 29.59,20.68 29.59,17.68 | 29.59,17.68 29.59,14.68 | 29.59,14.68 29.59,11.65 | 29.59,11.65 29.59,8.68 | 29.59,8.68 29.59,5.68 LED114.R | LED101.R 29.59,8.68 | LED88.R 29.05,11.65 29.59,11.65 | LED75.R 29.59,14.68 | LED62.R 29.59,17.68 | LED49.R 29.59,20.68 | LED36.R 29.59,23.68 | LED23.R 29.05,26.64 29.59,26.64 | 29.59,29.75 29.59,32.01 30.62,33.03 R19.2
N$71
  Top 0.178: LED114.B 26.95,7.78 26.95,10.77 | 26.95,28.78 26.95,31.08 27.65,31.78 LED10.B 28.14,31.97 28.14,31.99 28.62,32.48 R6.7 | 26.95,25.75 26.95,22.78 | 26.95,22.78 26.95,19.91 | 26.95,19.91 26.95,16.89 26.95,16.78 | 26.95,13.78 26.95,16.78 | 26.95,13.78 26.95,10.77 | LED101.B 27.95,10.77 26.95,10.77 | LED88.B 26.95,13.78 | LED75.B 26.95,16.78 | LED62.B 27.95,19.91 26.95,19.91 | LED49.B 26.95,22.78 | 27.95,25.75 LED36.B 27.95,25.75 | 27.95,25.75 26.95,25.75 | 27.95,25.75 26.95,25.75 | 26.95,25.75 26.95,28.78 | 26.95,28.78 LED23.B | 26.95,16.78
N$73
  Top 0.178: LED11.G 32.66,31.78 | LED115.G 32.66,7.78 32.66,10.89 | 32.66,31.78 32.66,28.78 | 32.66,28.78 32.66,25.78 | 32.66,25.78 32.66,22.78 | 32.66,22.78 32.66,19.78 | 32.66,19.78 32.66,16.78 | 32.66,16.78 32.66,13.78 | 32.66,13.78 32.66,10.89 | LED102.G 32.05,10.89 32.66,10.89 | LED89.G 32.66,13.78 | LED76.G 32.66,16.78 | LED63.G 32.66,19.78 | LED50.G 32.66,22.78 | LED37.G 32.66,25.78 | LED24.G 32.66,28.78 | R8.6 34.36,33.02 33.7,32.37 33.37,32.37 32.78,31.78 32.66,31.78
N$75
  Top 0.178: LED116.R 35.05,5.81 35.59,5.81 35.59,8.61 | 35.59,8.61 35.59,11.65 | 35.59,11.65 35.59,14.7 | 35.59,14.7 35.59,17.75 | 35.59,17.75 35.59,20.67 | 35.59,20.67 35.59,23.68 | 35.59,23.68 35.59,26.68 35.05,26.68 | LED25.R 35.05,26.68 | LED38.R 35.59,23.68 | LED103.R 35.52,8.68 35.59,8.61 | LED90.R 35.57,11.68 35.59,11.65 | LED77.R 35.57,14.68 35.59,14.7 | LED64.R 35.52,17.68 35.59,17.75 | LED51.R 35.58,20.68 35.59,20.67 | R21.2 32.95,38.5 35.03,36.42 35.61,36.42 36.58,35.45 36.58,32.59 35.66,31.67 35.66,31.35 35.02,30.71 35.02,29.71 LED12.R 35.15,29.68 35.59,29.23 35.59,28.29 35.05,27.75 35.05,26.68
N$77
  Top 0.178: 33.03,28.67 33.03,31.34 33.51,31.81 LED12.B 34.67,32.5 34.69,32.5 35.16,32.97 R8.7 | 33.03,28.67 33.03,25.75 | 33.03,25.75 33.03,22.7 | 33.03,13.78 33.03,10.78 | 33.03,10.78 33.03,7.78 LED116.B | LED103.B 33.03,10.78 | LED64.B 33.16,19.78 33.03,19.91 | LED51.B 33.1,22.78 33.03,22.7 | LED38.B 33.06,25.78 33.03,25.75 | LED25.B 33.13,28.78 33.03,28.67 | LED90.B 33.03,13.78 | 33.03,22.7 33.03,19.91 | 33.03,13.78 33.03,16.76 | 33.03,16.76 33.03,19.91 | 33.03,16.76 33.04,16.78 LED77.B
N$79
  Top 0.178: LED117.G 37.49,7.78 37.49,10.78 | 37.49,28.78 37.49,31.78 LED13.G 37.81,32.02 R9.2 | 37.49,28.78 37.49,25.78 | 37.49,25.78 37.49,22.78 | 37.49,22.78 37.49,19.78 | 37.49,19.78 37.49,16.78 | 37.49,16.78 37.49,13.78 | 37.49,13.78 37.49,10.78 | LED104.G 37.49,10.78 | LED91.G 37.49,13.78 | LED78.G 37.49,16.78 | LED65.G 37.49,19.78 | LED52.G 37.49,22.78 | LED39.G 37.49,25.78 | LED26.G 37.49,28.78
R1  (via drill 0.39)
  Top 0.152: 1.49,28.28 1.72,28.06 2.27,28.06
  Top 0.178: v2.37,30.78 2.37,30.1 LED1.R 1.49,29.22 1.49,28.28 | R10.2 4.22,36.89 2.77,36.89 v2.15,36.27 | LED27.R 2.05,23.75 | 2.05,23.75 1.67,23.37 1.49,23.2 1.49,22.3 1.67,22.12 1.8,21.99 2.18,21.99 2.33,21.83 2.33,20.96 LED40.R 1.97,20.68 1.51,20.21 1.51,19.28 1.79,19 2.33,19 2.33,17.96 LED53.R 1.96,17.77 1.5,17.31 1.5,16.41 1.53,16.37 1.53,16.26 1.68,16.11 2.28,16.11 2.33,16.06 2.33,14.96 LED66.R 1.76,14.68 1.49,14.42 1.49,13.3 1.73,13.06 2.1,13.06 2.24,12.92 2.24,11.75 2.05,11.75 | LED79.R 2.05,11.75 | LED92.R 2.05,8.7 | 2.05,8.7 2.05,9.65 1.49,10.21 1.49,11.21 1.48,11.23 2,11.75 2.05,11.75 | LED105.R 2.04,6.46 1.49,7.02 1.49,8.41 1.78,8.7 2.05,8.7 | 2.27,28.06 2.27,26.9 LED14.R 2.05,26.86 1.51,26.32 1.51,25.28 1.53,25.26 1.88,24.91 2.08,24.91 2.08,23.78 2.05,23.75
  Bottom 0.178: v2.15,36.27 2.27,36.15 2.27,30.88 v2.37,30.78
R2
  Top 0.178: LED2.R 5.61,29.68 | LED106.R 5.61,5.68 5.61,8.68 | 5.61,26.68 5.61,29.68 | 5.61,26.68 5.61,23.68 | 5.61,23.68 5.61,20.68 | 5.61,20.68 5.61,17.68 | 5.61,17.68 5.61,14.68 | 5.61,14.68 5.61,11.68 | 5.61,11.68 5.61,8.68 | LED93.R 5.61,8.68 | LED80.R 5.61,11.68 | LED67.R 5.61,14.68 | LED54.R 5.61,17.68 | LED41.R 5.61,20.68 | LED28.R 5.61,23.68 | LED15.R 5.61,26.68 | 5.61,29.68 5.61,32.71 R11.2
SCL  (via drill 0.39)
  Top 0.178: v23.41,46.26 23.41,45.88 22.27,44.74 20.7,44.74 X1.10 | R7.8 30.2,45.06 30.62,45.45 30.63,45.45 CONN1.4 30.75,47.43 v30.7,47.48 | CONN2.4 5.25,47.13 v5.3,47.18
  Bottom 0.178: v23.41,46.26 23.35,46.32 23.35,49.51 22.34,50.52 | 22.34,50.52 18.4,50.52 17.03,49.15 16.96,49.22 | v5.3,47.18 8.6,50.48 15.7,50.48 16.96,49.22 | 22.34,50.52 27.66,50.52 v30.7,47.48 30.7,45.49 SJ2.2 | JP5.3 16.96,49.22
SDA  (via drill 0.39)
  Top 0.178: X1.9 20.03,43.55 20.81,44.32 22.42,44.32 24.19,46.1 24.19,47.18 23.3,48.07 23.3,50.64 | 21.45,50.63 19.5,48.69 JP5.4 | 21.45,50.63 22.45,50.63 22.45,50.64 23.3,50.64 | R7.7 28.28,44.16 28.6,44.48 31.3,44.48 31.75,44.93 CONN1.3 32.13,45.95 v32.13,47.12 32.13,49.51 31,50.64 23.3,50.64 | 21.45,50.63 7.55,50.63 6.25,49.33 CONN2.3
  Bottom 0.178: SJ3.2 30.99,43.18 32.13,44.32 v32.13,47.12
SHUTDOWN  (via drill 0.39)
  Top 0.178: X1.11 20.55,45.14 22.14,45.14 22.68,45.68 22.68,47.94 JP5.5 | R7.4 25.01,42.46 v24.95,42.52
  Bottom 0.178: v24.95,42.52 22.15,45.32 22.1,45.32 22.1,48.51 JP5.5
SW1  (via drill 0.3, 0.39)
  Top 0.178: LED91.A 36.83,11.8 v36.83,12.76 | v3.76,12.76 3.95,12.57 LED80.A | LED81.A 6.83,11.8 v6.83,12.76 | LED82.A 9.82,11.8 v9.82,12.76 | LED83.A 12.76,11.87 v12.76,12.76 | LED84.A 15.82,11.8 v15.82,12.76 | LED85.A 18.82,11.8 v18.82,12.76 | LED86.A 21.84,11.79 v21.84,12.76 | LED87.A 24.82,11.8 v24.82,12.76 | LED88.A 27.82,11.8 v27.82,12.76 | LED89.A 30.84,11.79 v30.84,12.76 | LED90.A 33.84,11.79 v33.84,12.76 | LED79.A 0.94,12.21 v1.34,12.61 | X1.16 17.44,45.2 16.61,46.03 v16.83,46.26
  Bottom 0.178: v1.34,12.61 3.6,12.61 v3.76,12.76 v6.83,12.76 v9.82,12.76 v12.76,12.76 v15.82,12.76 v18.82,12.76 v21.84,12.76 v24.82,12.76 v27.82,12.76 v30.84,12.76 v33.84,12.76 v36.83,12.76 36.83,14.74 37.49,15.41 37.49,17.89 38.6,19 38.6,29.12 38.63,29.15 38.63,32.48 37.58,33.54 37.3,33.54 34.24,36.6 22.36,36.6 16.83,42.13 v16.83,46.26
SW2  (via drill 0.3, 0.39)
  Top 0.178: LED78.A 36.83,14.8 v36.83,15.68 | v3.76,15.75 3.76,14.87 LED67.A | LED68.A 6.83,14.8 v6.83,15.68 | LED69.A 9.82,14.8 v9.82,15.68 | LED70.A 12.82,14.8 v12.82,15.68 | LED71.A 15.82,14.8 v15.82,15.68 | LED72.A 18.8,14.83 v18.8,15.68 | LED73.A 21.78,14.85 v21.78,15.68 | LED74.A 24.82,14.8 v24.82,15.68 | LED75.A 27.82,14.8 v27.82,15.68 | LED76.A 30.84,14.79 v30.84,15.68 | LED77.A 33.69,14.94 v33.69,15.68 | LED66.A 0.95,15.2 1.4,15.65 v1.3,15.65 | v13.25,46.41 13.56,46.1 16.02,46.1 X1.17
  Bottom 0.178: v1.3,15.65 1.32,15.62 1.37,15.62 1.41,15.57 3.58,15.57 v3.76,15.75 3.82,15.68 v6.83,15.68 v9.82,15.68 v12.82,15.68 v15.82,15.68 v18.8,15.68 v21.78,15.68 v24.82,15.68 v27.82,15.68 v30.84,15.68 v33.69,15.68 v36.83,15.68 36.83,17.73 38.25,19.15 38.25,29.27 38.28,29.3 38.28,32.34 37.44,33.18 37.16,33.18 34.09,36.25 22.22,36.25 13.25,45.21 v13.25,46.41
SW3  (via drill 0.3, 0.39)
  Top 0.178: LED65.A 36.83,17.8 v36.83,18.73 | v3.76,18.67 3.76,17.87 LED54.A | LED55.A 6.83,17.8 v6.83,18.73 | LED56.A 9.82,17.8 v9.82,18.73 | LED57.A 12.82,17.8 v12.82,18.73 | LED58.A 15.68,17.95 v15.68,18.73 | LED59.A 18.82,17.8 v18.82,18.73 | LED60.A 21.84,17.79 v21.84,18.73 | LED61.A 24.82,17.8 v24.82,18.73 | LED62.A 27.82,17.8 v27.82,18.73 | LED63.A 30.84,17.79 v30.84,18.73 | LED64.A 33.84,17.79 v33.84,18.73 | LED53.A 0.94,18.18 v1.3,18.62 | X1.18 15.81,45.74 12.77,45.74 v12.27,46.24
  Bottom 0.178: v1.3,18.62 3.71,18.62 v3.76,18.67 3.82,18.73 v6.83,18.73 v9.82,18.73 v12.82,18.73 v15.68,18.73 v18.82,18.73 v21.84,18.73 v24.82,18.73 v27.82,18.73 v30.84,18.73 v33.84,18.73 v36.83,18.73 36.83,20.71 37.89,21.78 37.89,29.41 37.92,29.44 37.92,32.19 37.37,32.74 37.09,32.74 33.94,35.89 22.07,35.89 12.47,45.49 12.47,46.04 v12.27,46.24
SW4  (via drill 0.3, 0.39)
  Top 0.178: LED52.A 36.83,20.8 v36.83,21.72 | v3.76,21.72 3.76,20.87 LED41.A | LED42.A 6.83,20.8 v6.83,21.72 | LED43.A 9.82,20.8 v9.82,21.72 | LED44.A 12.82,20.8 v12.82,21.72 | LED45.A 15.97,21.59 v15.83,21.72 v15.82,21.72 | LED46.A 18.82,20.8 v18.82,21.72 | LED47.A 21.84,20.79 v21.84,21.72 | LED48.A 24.82,20.8 v24.82,21.72 | LED49.A 27.82,20.8 v27.82,21.72 | LED50.A 30.84,20.79 v30.84,21.72 | LED51.A 33.84,20.79 v33.84,21.72 | LED40.A 0.92,21.25 v1.3,21.63 | v11.29,45.69 11.6,45.38 15.61,45.38 X1.19
  Bottom 0.178: v33.84,21.72 33.96,21.72 v36.83,21.72 37.54,22.43 37.54,29.56 37.57,29.59 37.57,32.04 37.23,32.38 36.95,32.38 33.8,35.53 21.92,35.53 11.77,45.69 v11.29,45.69 | v1.3,21.63 3.67,21.63 v3.76,21.72 v6.83,21.72 v9.82,21.72 v12.82,21.72 v15.82,21.72 v18.82,21.72 v21.84,21.72 v24.82,21.72 v27.82,21.72 v30.84,21.72 v33.84,21.72 | v33.84,21.72
SW5  (via drill 0.3, 0.39)
  Top 0.178: LED39.A 36.83,23.8 v36.83,24.7 | v3.81,24.7 3.95,24.56 LED28.A | LED29.A 6.83,23.8 v6.83,24.7 | LED30.A 9.82,23.8 v9.82,24.7 | LED31.A 12.82,23.8 v12.82,24.7 | LED32.A 15.82,23.8 v15.82,24.7 | LED33.A 18.82,23.8 v18.82,24.7 | LED34.A 21.84,23.79 v21.84,24.7 | LED35.A 24.82,23.8 v24.82,24.7 | LED36.A 27.82,23.8 v27.82,24.7 | LED37.A 30.84,23.79 v30.84,24.7 | LED38.A 33.84,23.79 v33.84,24.7 | LED27.A 0.95,24.18 1.27,24.51 v1.3,24.64 | X1.20 16.31,44.06 15.35,45.02 10.59,45.02 v10.31,45.3
  Bottom 0.178: v1.3,24.64 1.34,24.57 3.68,24.57 v3.81,24.7 v6.83,24.7 v9.82,24.7 v12.82,24.7 v15.82,24.7 v18.82,24.7 v21.84,24.7 v24.82,24.7 v27.82,24.7 v30.84,24.7 v33.84,24.7 v36.83,24.7 37.18,25.06 37.18,29.71 37.21,29.74 37.21,31.82 37.01,31.82 33.65,35.18 30.04,35.18 30.01,35.15 21.8,35.15 12.24,44.72 10.89,44.72 v10.31,45.3
SW6  (via drill 0.3, 0.39)
  Top 0.178: LED26.A 36.38,27.25 v36.38,27.62 | v3.76,27.75 3.76,26.87 LED15.A | LED16.A 6.83,26.8 v6.83,27.75 | LED17.A 9.95,27.62 v9.82,27.75 | LED18.A 12.82,26.8 v12.82,27.75 | LED19.A 15.82,26.8 v15.82,27.75 | LED20.A 18.82,26.8 v18.82,27.75 | LED21.A 21.84,26.79 v21.84,27.75 | LED22.A 24.82,26.8 v24.82,27.75 | LED23.A 27.82,26.8 v27.82,27.75 | LED24.A 30.84,26.79 v30.84,27.75 | LED25.A 33.84,26.79 v33.84,27.75 | LED14.A 0.94,27.22 v1.32,27.61 | v9.87,44.36 10.31,44.36 10.61,44.67 15.19,44.67 X1.21
  Bottom 0.178: v1.32,27.61 3.62,27.61 v3.76,27.75 v6.83,27.75 v9.82,27.75 v12.82,27.75 v15.82,27.75 v18.82,27.75 v21.84,27.75 v24.82,27.75 v27.82,27.75 v30.84,27.75 v33.84,27.75 36.19,27.75 36.32,27.62 v36.38,27.62 36.25,27.75 36.57,27.75 36.57,29.6 36.86,29.89 36.86,31.47 33.53,34.8 21.65,34.8 12.09,44.36 v9.87,44.36
SW7  (via drill 0.39)
  Top 0.178: LED105.A 0.96,6.59 v0.84,6.7 | v3.75,6.75 3.95,6.55 LED106.A | LED107.A 6.96,6.5 v6.75,6.7 | LED108.A 9.96,6.5 v9.75,6.7 | LED109.A 12.96,6.5 v12.75,6.7 | LED110.A 15.96,6.5 v15.75,6.7 | LED111.A 18.96,6.5 v18.75,6.7 | LED112.A 21.96,6.5 v21.75,6.7 | LED113.A 24.96,6.5 v24.75,6.7 | LED114.A 27.95,6.5 v27.75,6.7 | LED115.A 30.75,5.88 v30.75,6.7 | LED116.A 33.96,6.5 v33.75,6.7 | LED117.A 36.96,6.5 v36.75,6.7 | v0.97,37.57 1.49,37.57 2.5,38.58 3.82,38.58 5.81,40.57 7.02,40.57 10.76,44.31 14.98,44.31 X1.22
  Bottom 0.178: v36.75,6.7 v33.75,6.7 v30.75,6.7 v27.75,6.7 v24.75,6.7 v21.75,6.7 v18.75,6.7 v15.75,6.7 v12.75,6.7 v9.75,6.7 v6.75,6.7 3.8,6.7 v3.75,6.75 0.89,6.75 v0.84,6.7 0.34,7.2 0.34,36.95 v0.97,37.57
SW8  (via drill 0.39)
  Top 0.178: LED104.A 36.95,9.4 v36.64,9.72 | LED103.A 33.84,8.79 v33.84,9.72 | LED102.A 30.91,8.76 30.91,9.65 v30.78,9.78 | LED101.A 27.95,9.59 v27.82,9.72 | LED100.A 24.95,9.59 v24.82,9.72 | v3.83,9.72 3.95,9.59 LED93.A | LED94.A 6.83,8.8 v6.83,9.72 | LED95.A 9.82,8.8 v9.82,9.72 | LED96.A 12.82,8.8 v12.82,9.72 | LED97.A 15.82,8.8 v15.82,9.72 | LED98.A 18.82,8.8 v18.82,9.72 | LED99.A 21.78,8.85 v21.78,9.72 | LED92.A 0.95,9.62 v1.04,9.72 | X1.23 14.77,43.95 10.91,43.95 7.17,40.22 5.96,40.22 3.92,38.18 3.82,38.18 3.77,38.23 3.22,38.23 2.65,37.66 v2.52,37.66
  Bottom 0.178: v36.64,9.72 v33.84,9.72 30.84,9.72 v30.78,9.78 30.71,9.72 v27.82,9.72 v24.82,9.72 v21.78,9.72 v18.82,9.72 v15.82,9.72 v12.82,9.72 v9.82,9.72 v6.83,9.72 v3.83,9.72 v1.04,9.72 0.7,10.06 0.7,36.36 1.68,37.34 2.2,37.34 v2.52,37.66
SW9  (via drill 0.3, 0.39)
  Top 0.178: LED13.A v36.19,30.44 v36.19,30.45 | v4.12,30.75 3.95,30.58 LED2.A | LED3.A 6.83,29.8 v6.83,30.73 | LED4.A 9.82,29.8 v9.82,30.73 | LED5.A 12.76,29.87 v12.76,30.73 | LED6.A 15.68,29.95 v15.68,30.73 | LED7.A 18.76,29.84 v18.76,30.73 | LED8.A 21.84,29.79 v21.84,30.73 | LED9.A 24.82,29.8 v24.82,30.73 | LED10.A 27.82,29.8 v27.82,30.73 | LED11.A 30.95,30.71 v30.92,30.73 | LED12.A 33.72,29.91 v33.72,30.73 | LED1.A 0.95,30.72 v1.44,30.72 | v3.49,37.56 3.8,37.56 6.1,39.86 7.32,39.86 11.05,43.6 14.51,43.6 15.18,42.93 X1.24
  Bottom 0.178: v36.19,30.45 33.99,30.45 v33.72,30.73 33.72,30.04 33.33,29.66 31.5,29.66 30.92,30.23 v30.92,30.73 v27.82,30.73 27.82,30.35 27.06,29.59 25.59,29.59 24.82,30.35 v24.82,30.73 v21.84,30.73 21.84,30.16 21.2,29.53 19.52,29.53 18.76,30.29 v18.76,30.73 17.87,29.84 16.57,29.84 v15.68,30.73 14.79,29.84 13.64,29.84 v12.76,30.73 11.87,29.84 10.71,29.84 v9.82,30.73 8.74,29.66 7.9,29.66 v6.83,30.73 3.87,30.73 | v4.12,30.75 3.89,30.75 3.87,30.73 | 3.87,30.73 3.17,30.04 1.54,30.04 1.44,30.14 v1.44,30.72 1.44,36.55 1.87,36.99 2.92,36.99 v3.49,37.56
VCC  (via drill 0.39)
  Top 0.178: X1.25 14.9,42.65 14.3,43.24 11.84,43.24 v11.43,42.83 | X1.14 | X1.14 X1.15 | 5.84,43.42 5.84,43.38
  Top 0.305: R7.5 27.85,43.28 | 27.85,43.28 R7.6 30.48,43.36 | CONN1.2 32.75,44.83 C4.1 31.33,43.02 32.16,42.18 32.77,42.18 | R7.2 26.52,44.16 27.4,43.28 27.85,43.28 | R7.2 R7.1 | 32.77,42.18 34,42.18 35.49,43.67 C3.1 35.59,44.66 35.59,45.91 C6.1 | X1.15 18.11,45.2 17.5,45.82 17.56,45.82 v17.97,46.23 | v32.77,42.09 32.77,42.18 | R7.2 25.11,44.16 v25.08,44.13
  Top 0.406: C4.1 31.33,43.36 30.48,43.36
  Top 0.508: C1.1 5.84,43.38 4.26,43.38 C5.1 2.86,44.78 2.86,46.5 C2.1 | 5.84,43.42 7.25,44.83 CONN2.2 7.25,47.23 v7.3,47.28
  Bottom 0.305: SJ1.2 31.83,41.15 v32.77,42.09 | v25.08,44.13 25.08,43.42 25.68,42.83 25.68,42.22 25.25,41.8 22.78,41.8 18.35,46.23 v17.97,46.23 17.21,46.99 13.7,46.99 13.55,47.14 13.31,47.14 JP5.1
  Bottom 0.508: v11.43,42.83 11.33,42.93 9.33,42.93 7.49,44.77 7.49,47.28 | 7.49,47.28 7.49,47.79 8.28,48.57 JP5.1 | v7.3,47.28 7.49,47.28

## Text on the board
tPlace: GND | SDA | ADDR | VCC | SCL | INT | EN | IS31FL3741 13x9 RGB
bPlace: 0x31 | 0x32 | 0x33 | i2c addr | 0x30 | IS31FL3741 I2C PWM / LED Matrix Driver